# Altium schematic sheet BMS-S10-V01-USBC.SchDoc
size A1; Organization: Protel International P/L; Address1: L3, 12a Rodborough Rd; Address2: Frenchs Forest; Address3: NSW; Address4: Australia 2086
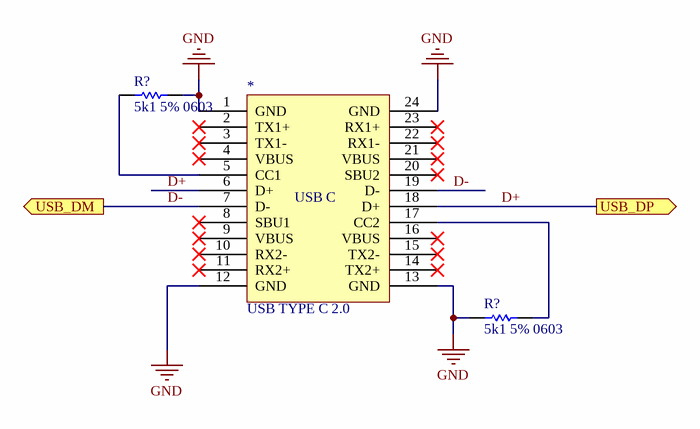
[diagram p0: BMS-S10-V01-USBC.SchDoc]

## Parts
(Parts that share a designator on the sheet are numbered #1, #2 ... from top to bottom, then left to right.)
*  USB TYPE C 2.0
R?#1  5k1 5% 0603  [Res_ThinFilm_0603]
R?#2  5k1 5% 0603  [Res_ThinFilm_0603]

## Ports
USB_DM (out), USB_DP (out)

## Nets
GND: *.1(GND) *.12(GND) *.13(GND) *.24(GND) R?#1.2 R?#2.1
D+: *.6(D+) *.18(D+) ; port USB_DP
D-: *.7(D-) *.19(D-) ; port USB_DM
Net*_5: *.5(CC1) R?#1.1
Net*_17: *.17(CC2) R?#2.2

Not connected (* = marked no-connect by the designer): * 2(TX1+)* 3(TX1-)* 4(VBUS)* 8(SBU1)* 9(VBUS)* 10(RX2-)* 11(RX2+)* 14(TX2+)* 15(TX2-)* 16(VBUS)* 20(SBU2)* 21(VBUS)* 22(RX1-)* 23(RX1+)*

## Notes on the sheet
- Title
- Size:
- Date:
- File:
- A1
- Number:
- Time:
- Revision:
- Sheet
- of
- (in symbol USB TYPE C 2.0) USB C

## Library data of the parts
R?#1 R?#2 = 5k1 5% 0603: Resistor, SMD, 5k1, 0.25W, 5%, 0603